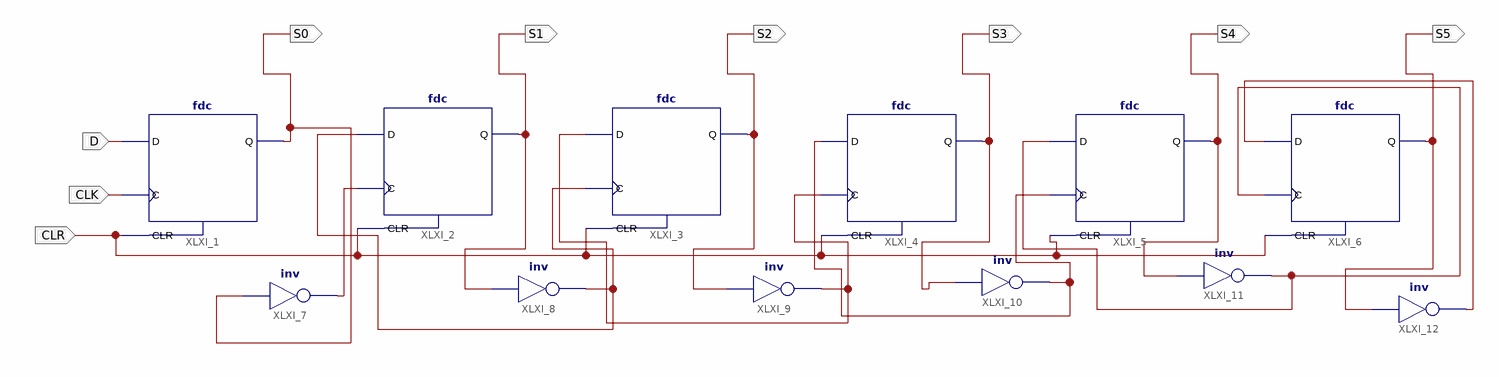
[diagram p0: schematic sheet 1]
// Xilinx ISE schematic ContadorD.sch (spartan3e) as structural Verilog: 12 symbols, 9 ports
module ContadorD (
  input  CLR,
  input  D,
  input  CLK,
  output S0,
  output S1,
  output S2,
  output S3,
  output S4,
  output S5
);

  wire XLXN_17, XLXN_20, XLXN_21, XLXN_25, XLXN_31, XLXN_33;

  fdc XLXI_1 (.C(CLK), .CLR(CLR), .D(D), .Q(S0));
  fdc XLXI_2 (.C(XLXN_17), .CLR(CLR), .D(XLXN_20), .Q(S1));
  fdc XLXI_3 (.C(XLXN_20), .CLR(CLR), .D(XLXN_21), .Q(S2));
  fdc XLXI_4 (.C(XLXN_21), .CLR(CLR), .D(XLXN_25), .Q(S3));
  fdc XLXI_5 (.C(XLXN_25), .CLR(CLR), .D(XLXN_31), .Q(S4));
  fdc XLXI_6 (.C(XLXN_31), .CLR(CLR), .D(XLXN_33), .Q(S5));
  not XLXI_7 (XLXN_17, S0);
  not XLXI_8 (XLXN_20, S1);
  not XLXI_9 (XLXN_21, S2);
  not XLXI_10 (XLXN_25, S3);
  not XLXI_11 (XLXN_31, S4);
  not XLXI_12 (XLXN_33, S5);
endmodule
